# Altium schematic sheet WIFI_Module.SchDoc
size A3; SheetNumber: 16; SheetTotal: 20
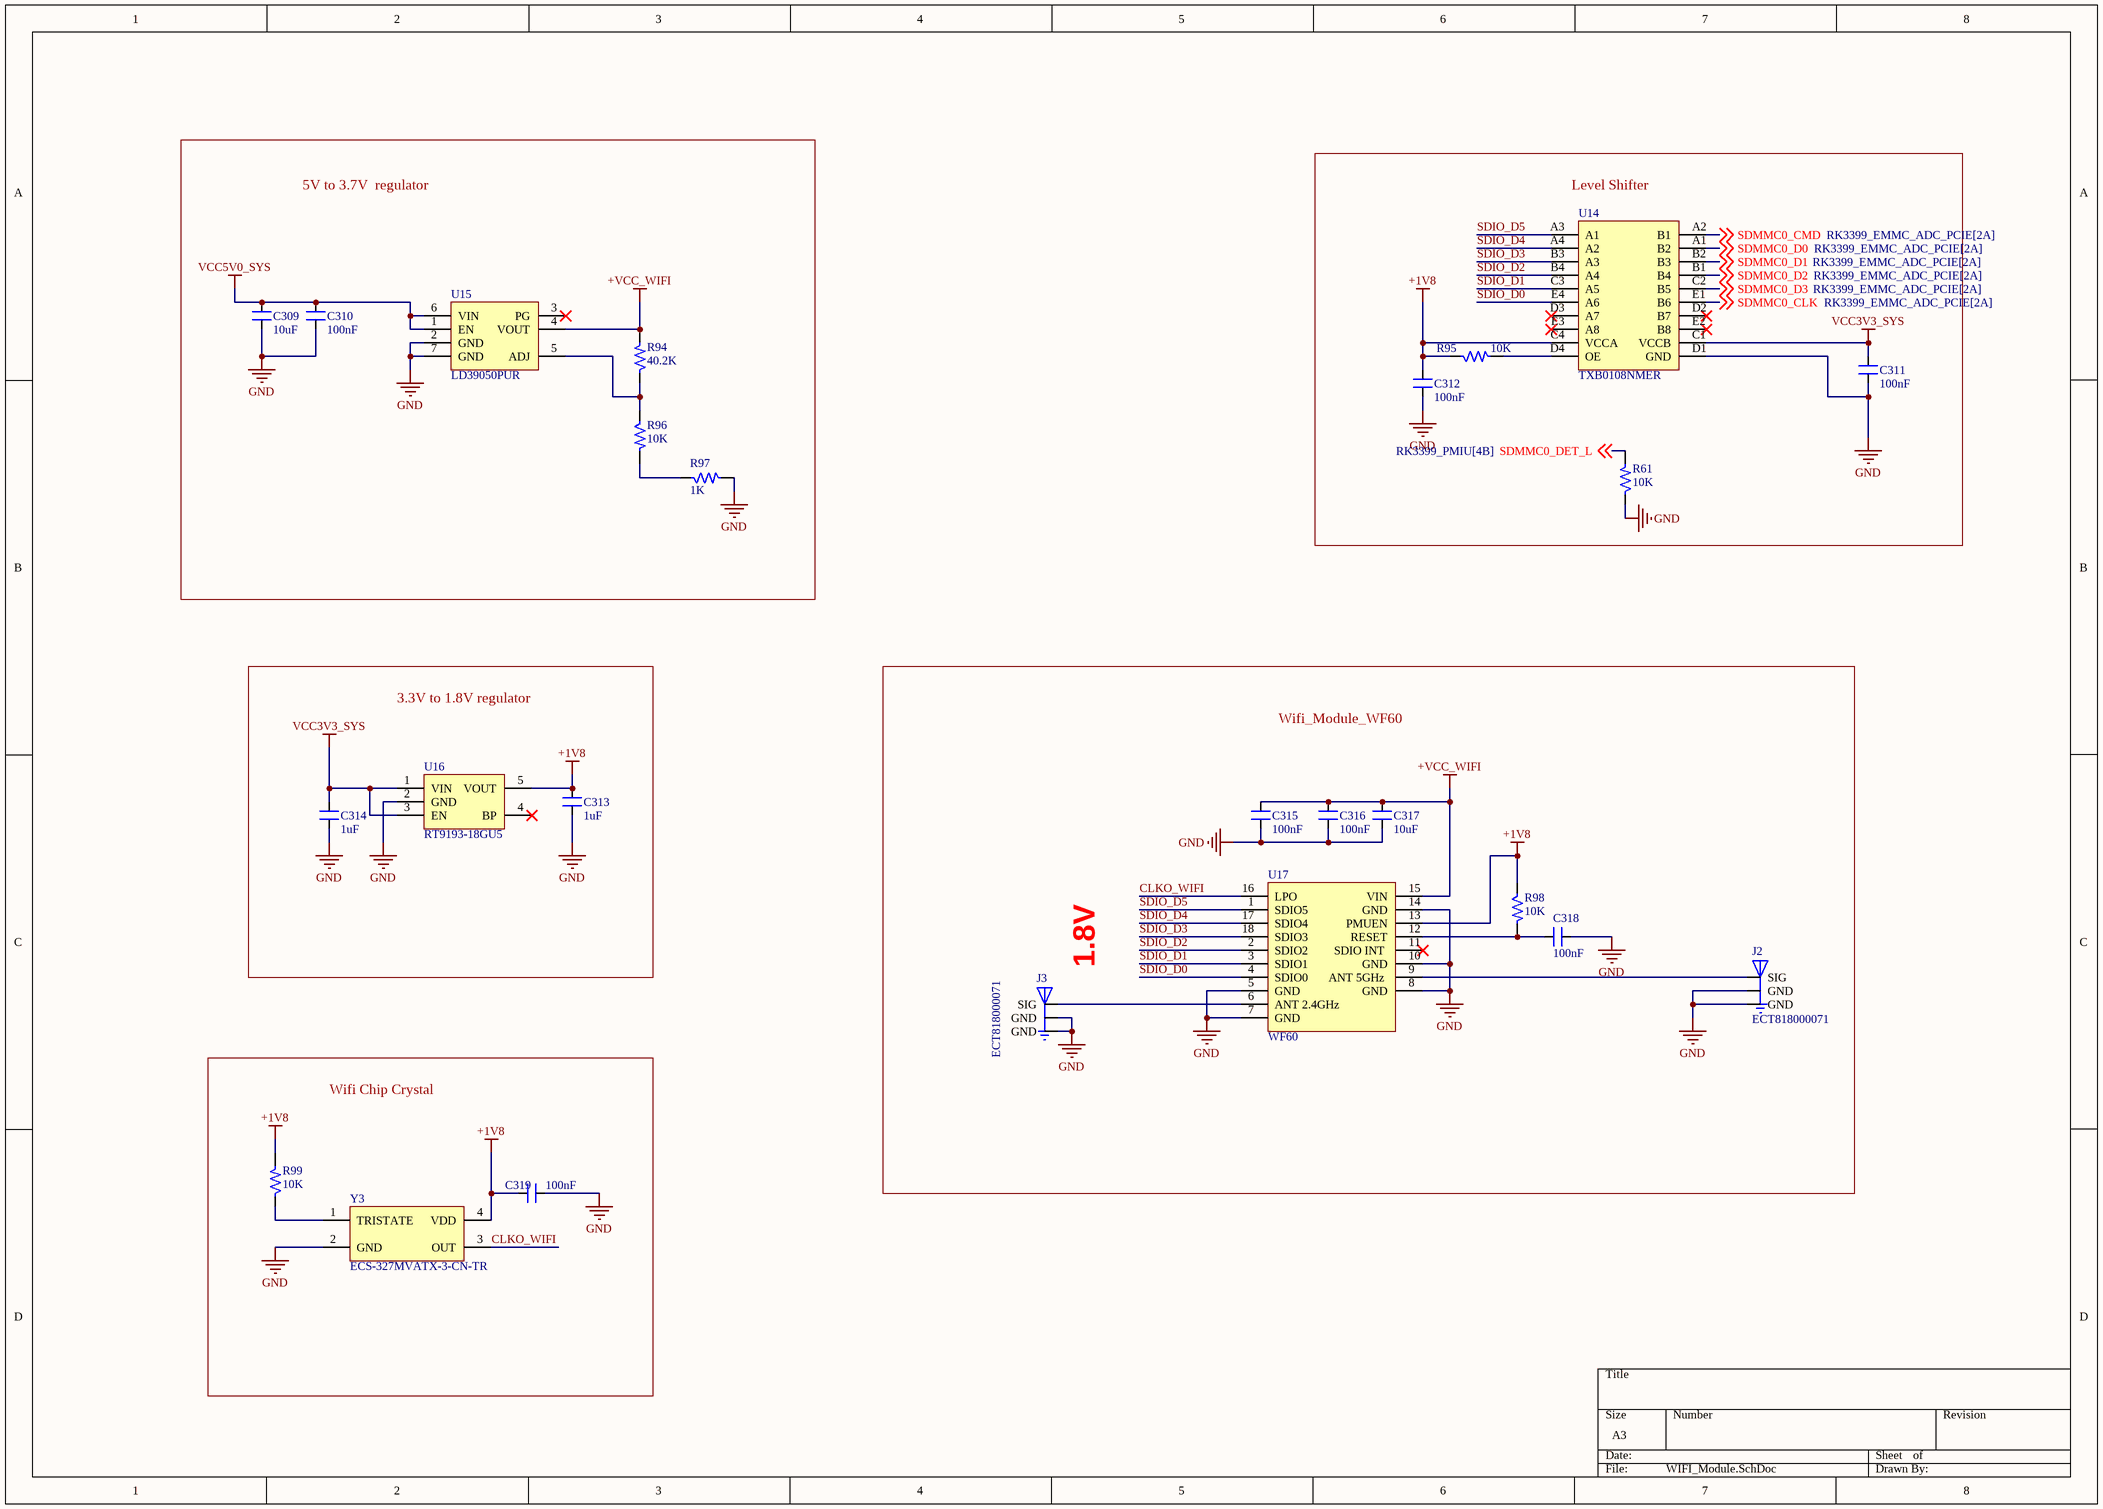
[diagram p0: WIFI_Module.SchDoc]

## Parts
C309  10uF  [CAP_0603]
C310  100nF  [CAP_0201]
C311  100nF  [CAP_0201]
C312  100nF  [CAP_0201]
C313  1uF  [CAP_0201]
C314  1uF  [CAP_0201]
C315  100nF  [CAP_0201]
C316  100nF  [CAP_0201]
C317  10uF  [CAP_0603]
C318  100nF  [CAP_0201]
C319  100nF  [CAP_0201]
J2  ECT818000071  [CON3_UFL_116_SMD_ST]
J3  ECT818000071  [CON3_UFL_116_SMD_ST]
R61  10K  [RES_0201]
R94  40.2K  [RES_0201]
R95  10K  [RES_0201]
R96  10K  [RES_0201]
R97  1K  [RES_0201]
R98  10K  [RES_0201]
R99  10K  [RES_0201]
U14  TXB0108NMER  [NFBGA_31.4_125.9X102.36]
U15  LD39050PUR  [DFN-6_37.4_165_33X15_SMD]
U16  RT9193-18GU5  [SC70-5]
U17  WF60  [MOD_WF60]
Y3  ECS-327MVATX-3-CN-TR  [XTAL_57_35X31_SMD]

## Blocks framed on the sheet
5V to 3.7V  regulator: C309 C310 R94 R96 R97 U15
Level Shifter: C311 C312 R61 R95 U14
3.3V to 1.8V regulator: C313 C314 U16
1.8V: C315-C318 J2 J3 R98 U17
Wifi Chip Crystal: C319 R99 Y3

## Nets
+1V8: C312.1 C313.2 C319.1 R95.1 R98.1 R99.2 U14.C4(VCCA) U16.5(VOUT) U17.13(PMUEN) Y3.4(VDD)
+VCC_WIFI: C315.1 C316.1 C317.2 R94.2 U15.4(VOUT) U17.15(VIN)
GND: C309.1 C310.2 C311.2 C312.2 C313.1 C314.1 C315.2 C316.2 C317.1 C318.2 C319.2 J2.1(GND) J2.3(GND) J3.1(GND) J3.3(GND) R61.1 R97.2 U14.D1(GND) U15.2(GND) U15.7(GND) U16.2(GND) U17.5(GND) U17.7(GND) U17.8(GND) U17.10(GND) U17.14(GND) Y3.2(GND)
VCC3V3_SYS: C311.1 C314.2 U14.C1(VCCB) U16.1(VIN) U16.3(EN)
VCC5V0_SYS: C309.2 C310.1 U15.1(EN) U15.6(VIN)
CLKO_WIFI: U17.16(LPO) Y3.3(OUT)
SDIO_D0: U14.E4(A6) U17.4(SDIO0)
SDIO_D1: U14.C3(A5) U17.3(SDIO1)
SDIO_D2: U14.B4(A4) U17.2(SDIO2)
SDIO_D3: U14.B3(A3) U17.18(SDIO3)
SDIO_D4: U14.A4(A2) U17.17(SDIO4)
SDIO_D5: U14.A3(A1) U17.1(SDIO5)
SDMMC0_CLK: U14.E1(B6) ; off-sheet SDMMC0_CLK
SDMMC0_CMD: U14.A2(B1) ; off-sheet SDMMC0_CMD
SDMMC0_D0: U14.A1(B2) ; off-sheet SDMMC0_D0
SDMMC0_D1: U14.B2(B3) ; off-sheet SDMMC0_D1
SDMMC0_D2: U14.B1(B4) ; off-sheet SDMMC0_D2
SDMMC0_D3: U14.C2(B5) ; off-sheet SDMMC0_D3
SDMMC0_DET_L: R61.2 ; off-sheet SDMMC0_DET_L
NetC318_1: C318.1 R98.2 U17.12(RESET)
NetJ2_2: J2.2(SIG) U17.9(ANT_5GHz)
NetJ3_2: J3.2(SIG) U17.6(ANT_2.4GHz)
NetR94_1: R94.1 R96.1 U15.5(ADJ)
NetR95_2: R95.2 U14.D4(OE)
NetR96_2: R96.2 R97.1
NetR99_1: R99.1 Y3.1(TRISTATE)

Not connected (* = marked no-connect by the designer): U14 D2(B7)* D3(A7)* E2(B8)* E3(A8)*; U15 3(PG)*; U16 4(BP)*; U17 11(SDIO_INT_)*

## Notes on the sheet
- Wifi_Module_WF60

## Library data of the parts
C309 C317 = CAP_10uF-10V-10%-0603: 10µF ±10% 10V Ceramic Capacitor X5R 0603 (1608 Metric); Manufacturer Part Number: GRM188R61A106KE69J; Manufacturer: Murata Electronics; Case/Package: 0603; Supplier-1: Digikey
C310-C312 C315 C316 C318 C319 = CAP_100nF-25V-10%-0201: 0.1µF ±10% 25V Ceramic Capacitor X5R 0201 (0603 Metric); Manufacturer: TDK Corporation; Manufacturer Part Number: C0603X5R1E104K030BB; Case/Package: 0201; Supplier-1: Digikey
C313 C314 = CAP_1uF-16V-10%-0201: 1µF ±20% 16V Ceramic Capacitor X5R 0201 (0603 Metric); Manufacturer: Samsung Electro-Mechanics; Manufacturer Part Number: CL03A105MO3NRNH; Case/Package: 0201; Supplier-1: Digikey
J2 J3 = CON-PLG_3X1-ECT818000071-ST-SMD: SMD RF Connectors/Coaxial Connectors RoHS; Manufacturer: ECT; Manufacturer Part Number: ECT818000071; Case/Package: SMD; Supplier-1: LCSC
R61 R95 R96 R98 R99 = RES_10K-0.05W-1%-0201: 10 kOhms ±1% 0.05W, 1/20W Chip Resistor 0201 (0603 Metric) Thick Film; Manufacturer: Stackpole Electronics Inc; Manufacturer Part Number: RMCF0201FT10K0; Case/Package: 0201; Supplier-1: Digikey
R94 = RES_40.2K-0.05W-1%-0201: 40.2 kOhms ±1% 0.05W, 1/20W Chip Resistor 0201 (0603 Metric) Automotive AEC-Q200, Moisture Resistant Thick Film; Manufacturer: Yageo; Manufacturer Part Number: AC0201FR-0740K2L; Case/Package: 0201; Supplier-1: Digikey
R97 = RES_1K-0.05W-1%-0201: 1 kOhms ±1% 0.05W, 1/20W Chip Resistor 0201 (0603 Metric) Thick Film; Manufacturer: Yageo; Manufacturer Part Number: RC0201FR-071KL; Case/Package: 0201; Supplier-1: Digikey
U14 = IC_TXB0108NMER: Translation - Voltage Levels 8-Bit Bidirectional Voltage-Level Shifter with Auto Direction Sensing and +/-15-kV ESD Protect; Manufacturer: Texas Instruments; Manufacturer Part Number: TXB0108NMER; Case/Package: NFBGA-20; Supplier-1: Mouser
U15 = REG_5.5V-0~5.1V-0.5A-2.55W-DFN-6: Adjustable 5.5V 0.8V 500mA DFN-6 Linear Voltage Regulators RoHS; Manufacturer: STMicroelectronics; Alternate Part Number-1: NA; Manufacturer Part Number: LD39050PUR; Case/Package: DFN-6; Supplier-1: LCSC; Supplier Part Number-1: C222094; Category: Regulators; Number of Pins: 6
U16 = REG_1.8V-300mA-5.5V-SC70-5: Linear Voltage Regulator IC 1 Output 300mA SC-70-5; Manufacturer: Richtek USA Inc.; Manufacturer Part Number: RT9193-18GU5; Case/Package: SC70-5; Supplier-1: Digikey
U17 = MOD_WF60-SMD: Amp’ed RF Tech presents the WF60 WiFi dual / band module: 802.11abgn.; Alternate Part Number-1: NA; Manufacturer: Amp’ed; Manufacturer Part Number: WF60; Case/Package: SMD; Supplier-1: Arrow; Supplier Part Number-1: WF60; Category: Module; Number of Pins: 16
Y3 = XTAL_ECS-327MVATX-2-CN-TR: 32.768kHz XO (Standard) CMOS Oscillator 1.6V ~ 3.6V Enable/Disable 4-SMD, No Lead; Manufacturer: ECS INC; Alternate Part Number-1: NA; Manufacturer Part Number: ECS-327MVATX-3-CN-TR; Case/Package: SMD-4; Supplier-1: Digikey; Supplier Part Number-1: ECS-327MVATX-3-CN-TR; Category: Crystal; Number of Pins: 4